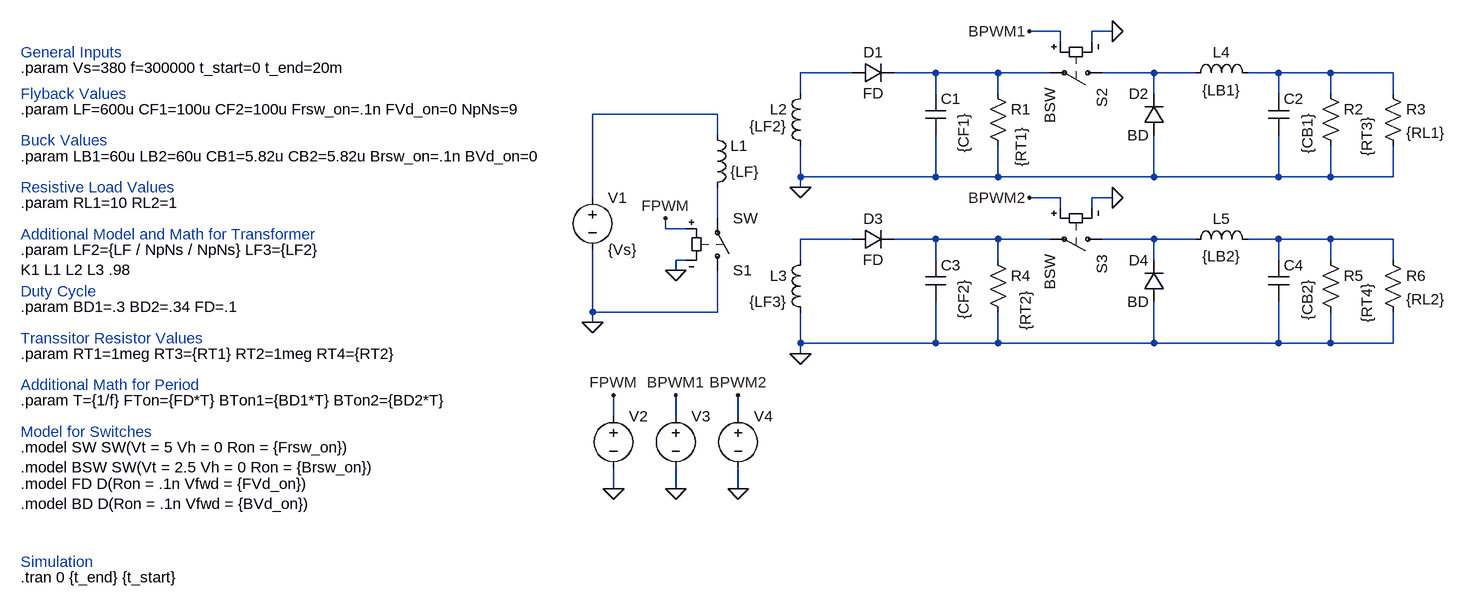
[diagram p0: schematic 2OFlybacktoBuckSPICE.asc]
2OFlybacktoBuckSPICE.asc, the LTspice schematic file:
Version 4.1
SHEET 1 1440 776
WIRE 832 -80 784 -80
WIRE 912 -80 880 -80
WIRE 832 -64 832 -80
WIRE 880 -64 880 -80
WIRE 512 -16 432 -16
WIRE 640 -16 576 -16
WIRE 736 -16 640 -16
WIRE 816 -16 736 -16
WIRE 976 -16 896 -16
WIRE 1040 -16 976 -16
WIRE 1168 -16 1120 -16
WIRE 1248 -16 1168 -16
WIRE 1344 -16 1248 -16
WIRE 432 16 432 -16
WIRE 640 16 640 -16
WIRE 736 16 736 -16
WIRE 976 16 976 -16
WIRE 1168 16 1168 -16
WIRE 1248 16 1248 -16
WIRE 1344 16 1344 -16
WIRE 304 48 112 48
WIRE 304 80 304 48
WIRE 432 144 432 96
WIRE 640 144 640 80
WIRE 640 144 432 144
WIRE 736 144 736 96
WIRE 736 144 640 144
WIRE 976 144 976 80
WIRE 976 144 736 144
WIRE 1168 144 1168 80
WIRE 1168 144 976 144
WIRE 1248 144 1248 96
WIRE 1248 144 1168 144
WIRE 1344 144 1344 96
WIRE 1344 144 1248 144
WIRE 432 160 432 144
WIRE 112 176 112 48
WIRE 832 176 784 176
WIRE 912 176 880 176
WIRE 832 192 832 176
WIRE 880 192 880 176
WIRE 304 208 304 160
WIRE 224 224 224 208
WIRE 256 224 224 224
WIRE 512 240 432 240
WIRE 640 240 576 240
WIRE 736 240 640 240
WIRE 816 240 736 240
WIRE 976 240 896 240
WIRE 1040 240 976 240
WIRE 1168 240 1120 240
WIRE 1248 240 1168 240
WIRE 1344 240 1248 240
WIRE 256 272 240 272
WIRE 432 272 432 240
WIRE 640 272 640 240
WIRE 736 272 736 240
WIRE 976 272 976 240
WIRE 1168 272 1168 240
WIRE 1248 272 1248 240
WIRE 1344 272 1344 240
WIRE 240 288 240 272
WIRE 112 352 112 256
WIRE 304 352 304 288
WIRE 304 352 112 352
WIRE 112 368 112 352
WIRE 432 400 432 352
WIRE 640 400 640 336
WIRE 640 400 432 400
WIRE 736 400 736 352
WIRE 736 400 640 400
WIRE 976 400 976 336
WIRE 976 400 736 400
WIRE 1168 400 1168 336
WIRE 1168 400 976 400
WIRE 1248 400 1248 352
WIRE 1248 400 1168 400
WIRE 1344 400 1344 352
WIRE 1344 400 1248 400
WIRE 432 416 432 400
WIRE 144 512 144 480
WIRE 240 512 240 480
WIRE 336 512 336 480
WIRE 144 624 144 592
WIRE 240 624 240 592
WIRE 336 624 336 592
FLAG 112 368 0
FLAG 432 416 0
FLAG 432 160 0
FLAG 240 288 0
FLAG 912 176 0
FLAG 912 -80 0
FLAG 144 624 0
FLAG 240 624 0
FLAG 144 480 FPWM
FLAG 240 480 BPWM1
FLAG 224 208 FPWM
FLAG 784 -80 BPWM1
FLAG 784 176 BPWM2
FLAG 336 624 0
FLAG 336 480 BPWM2
SYMBOL sw 304 304 M180
SYMATTR InstName S1
SYMBOL ind 288 176 M180
WINDOW 0 36 80 Left 2
WINDOW 3 36 40 Left 2
SYMATTR InstName L1
SYMATTR Value {LF}
SYMATTR Type ind
SYMBOL ind 448 0 M0
WINDOW 3 36 66 Left 2
SYMATTR InstName L2
SYMATTR Value {LF2}
SYMATTR Type ind
SYMBOL voltage 112 160 R0
SYMATTR InstName V1
SYMATTR Value {Vs}
SYMBOL diode 512 0 R270
WINDOW 0 32 32 VTop 2
WINDOW 3 0 32 VBottom 2
SYMATTR InstName D1
SYMATTR Value FD
SYMBOL cap 624 16 R0
WINDOW 3 59 92 VLeft 2
SYMATTR InstName C1
SYMATTR Value {CF1}
SYMBOL res 720 0 R0
WINDOW 3 51 129 VLeft 2
SYMATTR InstName R1
SYMATTR Value {RT1}
SYMBOL sw 912 -16 R90
SYMATTR InstName S2
SYMATTR Value BSW
SYMBOL diode 992 80 R180
WINDOW 0 24 64 Left 2
WINDOW 3 24 0 Left 2
SYMATTR InstName D2
SYMATTR Value BD
SYMBOL ind 1024 0 R270
WINDOW 0 32 56 VTop 2
WINDOW 3 5 56 VBottom 2
SYMATTR InstName L4
SYMATTR Value {LB1}
SYMBOL cap 1152 16 R0
WINDOW 3 60 93 VLeft 2
SYMATTR InstName C2
SYMATTR Value {CB1}
SYMBOL res 1232 0 R0
WINDOW 3 72 113 VLeft 2
SYMATTR InstName R2
SYMATTR Value {RT3}
SYMBOL res 1328 0 R0
SYMATTR InstName R3
SYMATTR Value {RL1}
SYMBOL ind 448 256 M0
SYMATTR InstName L3
SYMATTR Value {LF3}
SYMATTR Type ind
SYMBOL diode 512 256 R270
WINDOW 0 32 32 VTop 2
WINDOW 3 0 32 VBottom 2
SYMATTR InstName D3
SYMATTR Value FD
SYMBOL cap 624 272 R0
WINDOW 3 59 92 VLeft 2
SYMATTR InstName C3
SYMATTR Value {CF2}
SYMBOL res 720 256 R0
WINDOW 3 58 125 VLeft 2
SYMATTR InstName R4
SYMATTR Value {RT2}
SYMBOL sw 912 240 R90
SYMATTR InstName S3
SYMATTR Value BSW
SYMBOL diode 992 336 R180
WINDOW 0 24 64 Left 2
WINDOW 3 24 0 Left 2
SYMATTR InstName D4
SYMATTR Value BD
SYMBOL ind 1024 256 R270
WINDOW 0 32 56 VTop 2
WINDOW 3 5 56 VBottom 2
SYMATTR InstName L5
SYMATTR Value {LB2}
SYMBOL cap 1152 272 R0
WINDOW 3 60 93 VLeft 2
SYMATTR InstName C4
SYMATTR Value {CB2}
SYMBOL res 1232 256 R0
WINDOW 3 72 113 VLeft 2
SYMATTR InstName R5
SYMATTR Value {RT4}
SYMBOL res 1328 256 R0
SYMATTR InstName R6
SYMATTR Value {RL2}
SYMBOL voltage 144 496 R0
WINDOW 3 24 96 Invisible 2
WINDOW 123 0 0 Left 0
WINDOW 39 0 0 Left 0
SYMATTR InstName V2
SYMATTR Value PULSE(0 10 0 1n 1n {FTon} {T})
SYMBOL voltage 240 496 R0
WINDOW 3 24 96 Invisible 2
WINDOW 123 0 0 Left 0
WINDOW 39 0 0 Left 0
SYMATTR InstName V3
SYMATTR Value PULSE(0 5 0 1n 1n {BTon1} {T})
SYMBOL voltage 336 496 R0
WINDOW 3 24 96 Invisible 2
WINDOW 123 0 0 Left 0
WINDOW 39 0 0 Left 0
SYMATTR InstName V4
SYMATTR Value PULSE(0 5 0 1n 1n {BTon2} {T})
TEXT -768 40 Left 2 !.param LF=600u CF1=100u CF2=100u Frsw_on=.1n FVd_on=0 NpNs=9
TEXT -768 256 Left 2 !.param LF2={LF / NpNs / NpNs} LF3={LF2}\nK1 L1 L2 L3 .98
TEXT -768 112 Left 2 !.param LB1=60u LB2=60u CB1=5.82u CB2=5.82u Brsw_on=.1n BVd_on=0
TEXT -768 16 Left 2 ;Flyback Values
TEXT -768 88 Left 2 ;Buck Values
TEXT -768 232 Left 2 ;Additional Model and Math for Transformer
TEXT -768 -24 Left 2 !.param Vs=380 f=300000 t_start=0 t_end=20m
TEXT -768 -48 Left 2 ;General Inputs
TEXT -768 184 Left 2 !.param RL1=10 RL2=1
TEXT -768 160 Left 2 ;Resistive Load Values
TEXT -768 320 Left 2 ;Duty Cycle
TEXT -768 344 Left 2 !.param BD1=.3 BD2=.34 FD=.1
TEXT -768 392 Left 2 ;Transsitor Resistor Values
TEXT -768 416 Left 2 !.param RT1=1meg RT3={RT1} RT2=1meg RT4={RT2}
TEXT -768 464 Left 2 ;Additional Math for Period
TEXT -768 488 Left 2 !.param T={1/f} FTon={FD*T} BTon1={BD1*T} BTon2={BD2*T}
TEXT -768 536 Left 2 ;Model for Switches
TEXT -768 560 Left 2 !.model SW SW(Vt = 5 Vh = 0 Ron = {Frsw_on})\n.model BSW SW(Vt = 2.5 Vh = 0 Ron = {Brsw_on})
TEXT -768 616 Left 2 !.model FD D(Ron = .1n Vfwd = {FVd_on})\n.model BD D(Ron = .1n Vfwd = {BVd_on})
TEXT -768 760 Left 2 !.tran 0 {t_end} {t_start}
TEXT -768 736 Left 2 ;Simulation

The netlist it stands for:
* 2OFlybacktoBuckSPICE.asc
S1 0 N006 FPWM 0 SW
L1 N006 N005 {LF}
L2 N001 0 {LF2}
V1 N005 0 {Vs}
D1 N001 N002 FD
C1 N002 0 {CF1}
R1 N002 0 {RT1}
S2 N003 N002 BPWM1 0 BSW
D2 0 N003 BD
L4 N003 N004 {LB1}
C2 N004 0 {CB1}
R2 N004 0 {RT3}
R3 N004 0 {RL1}
L3 N007 0 {LF3}
D3 N007 N008 FD
C3 N008 0 {CF2}
R4 N008 0 {RT2}
S3 N009 N008 BPWM2 0 BSW
D4 0 N009 BD
L5 N009 N010 {LB2}
C4 N010 0 {CB2}
R5 N010 0 {RT4}
R6 N010 0 {RL2}
V2 FPWM 0 PULSE(0 10 0 1n 1n {FTon} {T})
V3 BPWM1 0 PULSE(0 5 0 1n 1n {BTon1} {T})
V4 BPWM2 0 PULSE(0 5 0 1n 1n {BTon2} {T})
.model D D
.lib standard.dio
.param LF=600u CF1=100u CF2=100u Frsw_on=.1n FVd_on=0 NpNs=9
.param LF2={LF / NpNs / NpNs} LF3={LF2}
K1 L1 L2 L3 .98
.param LB1=60u LB2=60u CB1=5.82u CB2=5.82u Brsw_on=.1n BVd_on=0
* Flyback Values
* Buck Values
* Additional Model and Math for Transformer
.param Vs=380 f=300000 t_start=0 t_end=20m
* General Inputs
.param RL1=10 RL2=1
* Resistive Load Values
* Duty Cycle
.param BD1=.3 BD2=.34 FD=.1
* Transsitor Resistor Values
.param RT1=1meg RT3={RT1} RT2=1meg RT4={RT2}
* Additional Math for Period
.param T={1/f} FTon={FD*T} BTon1={BD1*T} BTon2={BD2*T}
* Model for Switches
.model SW SW(Vt = 5 Vh = 0 Ron = {Frsw_on})
.model BSW SW(Vt = 2.5 Vh = 0 Ron = {Brsw_on})
.model FD D(Ron = .1n Vfwd = {FVd_on})
.model BD D(Ron = .1n Vfwd = {BVd_on})
.tran 0 {t_end} {t_start}
* Simulation
.backanno
.end